# EAGLE design untitled (EAGLE 7.7.0)
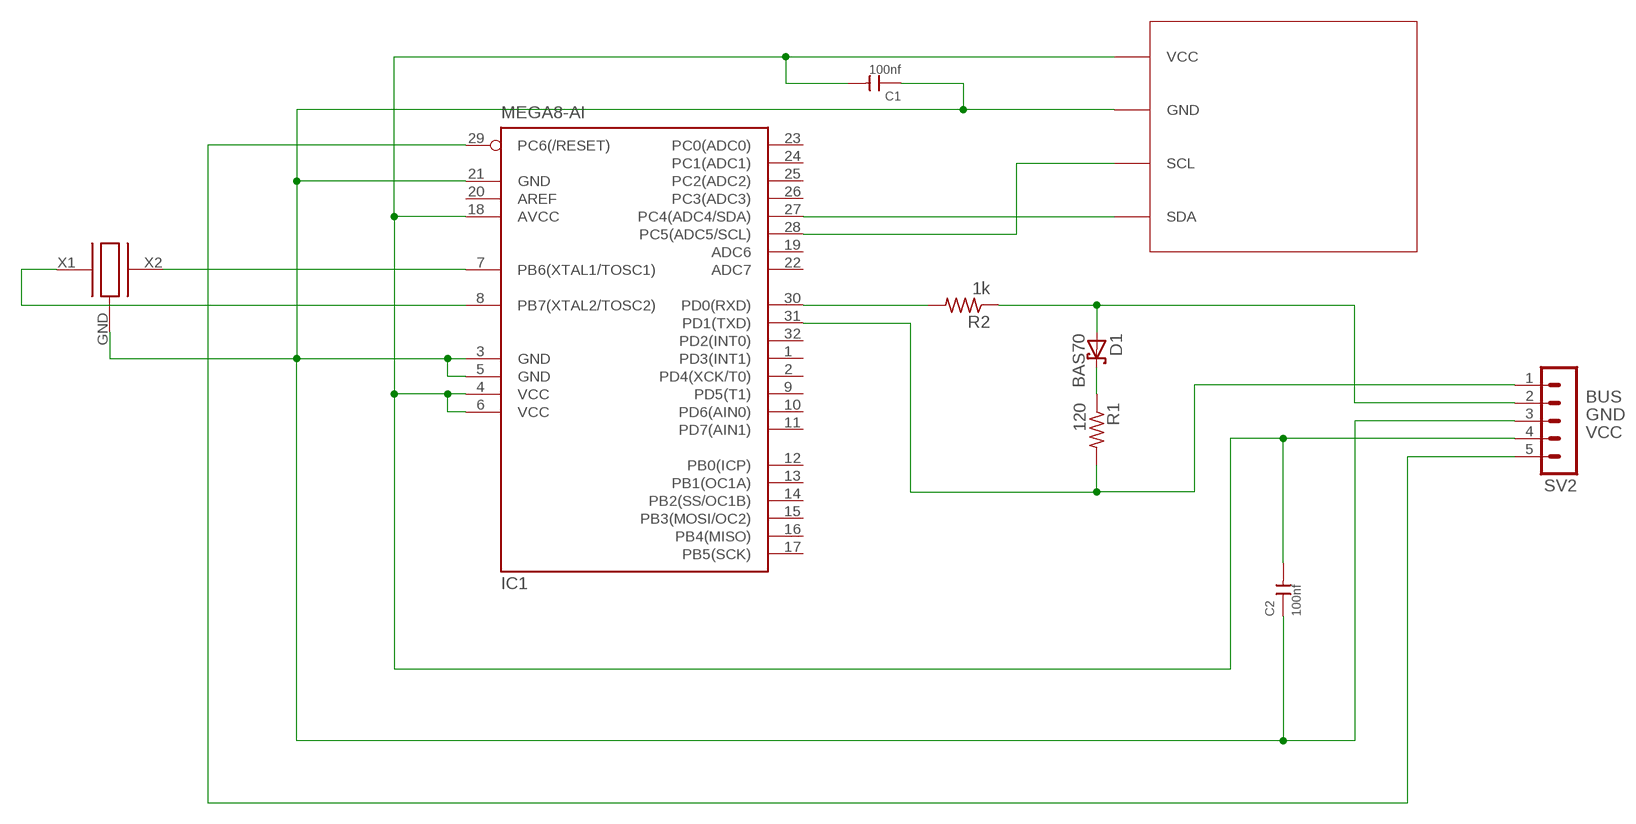
[diagram p0: schematic, sheet 1]

## Parts
C1  100nf  CERAMIC-10NF-50V-5%-X7R(0805)  [C0805]
C2  100nf  CERAMIC-10NF-50V-5%-X7R(0805)  [C0805]
D1  BAS70  [SOT23]
IC1  MEGA8-AI  [TQFP32-08]
R1  120  R-US_M0805  [M0805]
R2  1k  R-US_M0805  [M0805]
SV2  MA05-1  [MA05-1]
U$1  AMOLED_ADAFRUIT  [AMOLED_PCB]
U$2  MURATA_XTALL  [MURATA]

## Nets
BUS: D1.1(A) R2.1 SV2.2
GND: C1.1 C2.1 IC1.3(GND) IC1.5(GND) IC1.21(GND) SV2.3 U$1.GND U$2.GND
N$4: D1.3(C) R1.1
N$6: IC1.7(PB6(XTAL1/TOSC1)) U$2.X2
N$7: IC1.8(PB7(XTAL2/TOSC2)) U$2.X1
N$8: IC1.30(PD0(RXD)) R2.2
N$9: IC1.29(PC6(/RESET)) SV2.5
SCL: IC1.28(PC5(ADC5/SCL)) U$1.SCL
SDA: IC1.27(PC4(ADC4/SDA)) U$1.SDA
TX: IC1.31(PD1(TXD)) R1.2 SV2.1
VCC: C1.2 C2.2 IC1.4(VCC) IC1.6(VCC) IC1.18(AVCC) SV2.4 U$1.VCC
Unconnected: IC1.1(PD3(INT1)) IC1.2(PD4(XCK/T0)) IC1.9(PD5(T1)) IC1.10(PD6(AIN0)) IC1.11(PD7(AIN1)) IC1.12(PB0(ICP)) IC1.13(PB1(OC1A)) IC1.14(PB2(SS/OC1B)) IC1.15(PB3(MOSI/OC2)) IC1.16(PB4(MISO)) IC1.17(PB5(SCK)) IC1.19(ADC6) IC1.20(AREF) IC1.22(ADC7) IC1.23(PC0(ADC0)) IC1.24(PC1(ADC1)) IC1.25(PC2(ADC2)) IC1.26(PC3(ADC3)) IC1.32(PD2(INT0))

## Library data of the parts
C1 C2 = Seeed-OPL-Capacitor:CERAMIC-10NF-50V-5%-X7R(0805): 302010175; MPN: CC0805JRX7R9BB103; VALUE: 10nf
D1 = diode:BAS70: Silicon Schottky Diodes General-purpose diode for high-speed switching
IC1 = atmel:MEGA8: MICROCONTROLLER 8 Kbytes FLASH, 1 kbytes SRAM, 512 bytes EEPROM, USART, 6-channel 10 bit ADC, 2-channel 8 bit ADC Pin compatible with Atmega48, ATMega88, ATMega168 Source: avr.lbr; MPN: ATMEGA8-16AU; OC_FARNELL: 9171371; OC_NEWARK: 73M8863
R1 R2 = resistor:R-US_: RESISTOR, American symbol
SV2 = con-lstb:MA05-1: PIN HEADER; OC_FARNELL: unknown; OC_NEWARK: unknown
U$1 = 001aaa_my:AMOLED_ADAFRUIT
U$2 = 001aaa_my:MURATA_XTALL

## Board
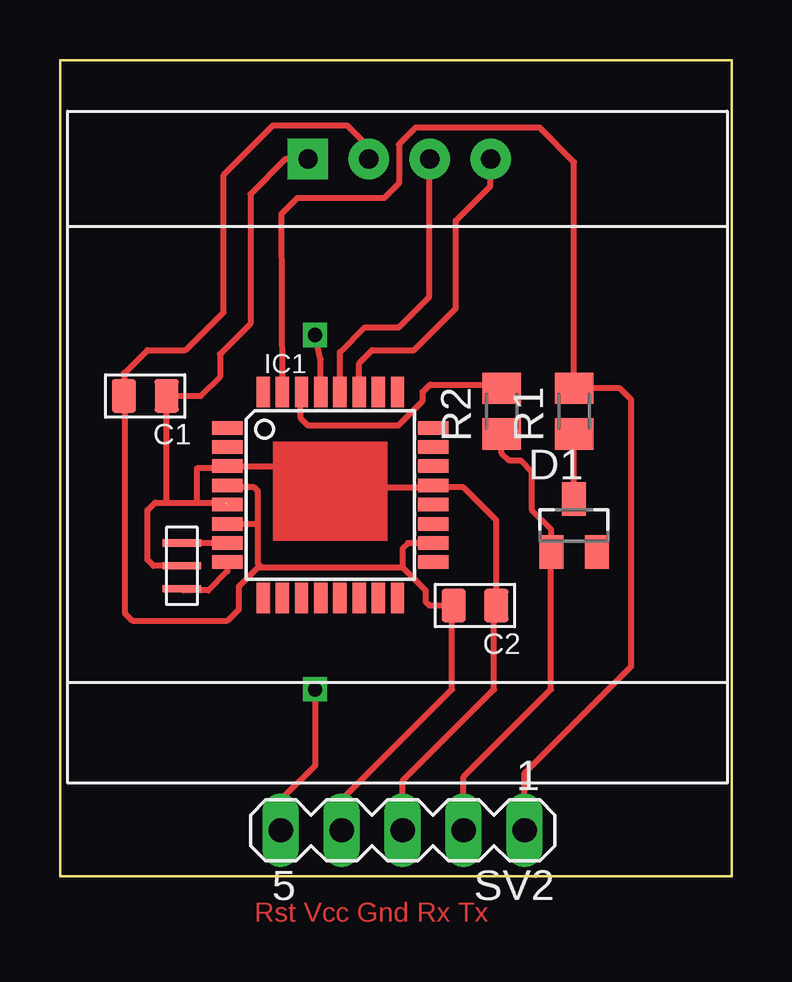
[diagram p1: board, top side]
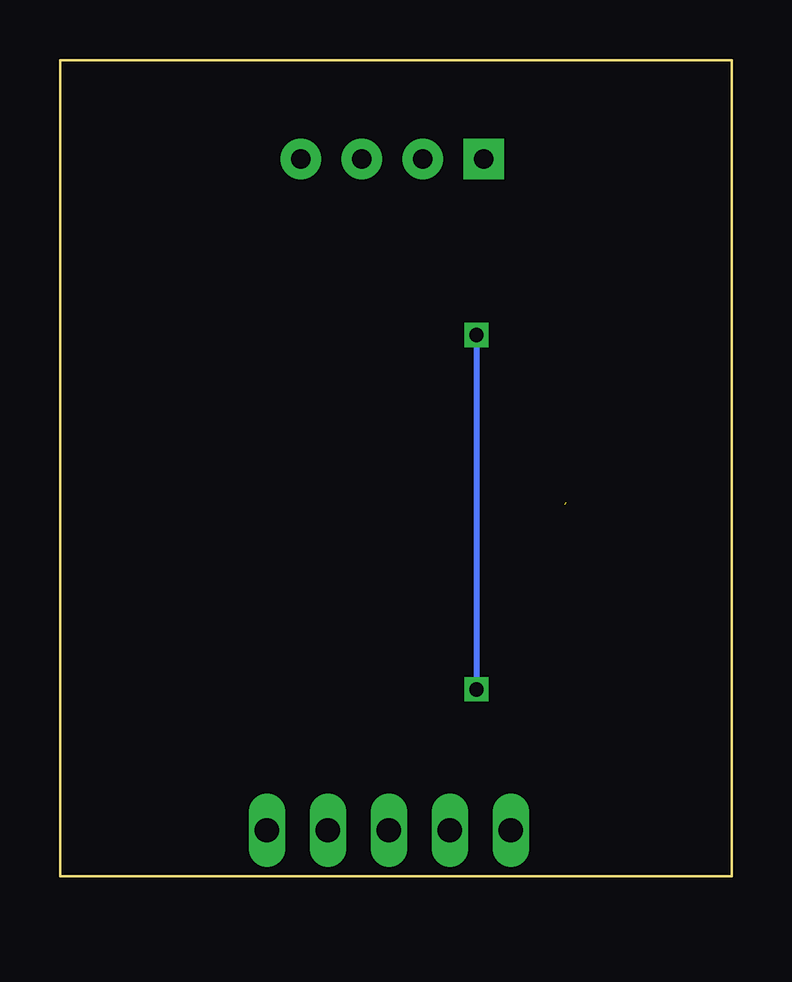
[diagram p2: board, bottom side, seen from below]

Size 28 x 34 mm. Coordinates in mm from the lower left corner, seen from the top.
Outline: 0,0 0,34 28,34 28,0 0,0
Copper layers (1*16): Top 0.035mm / dielectric 1.5mm / Bottom 0.035mm
Design rules "default": minimum track width 10mil, minimum drill 24mil, track to track 8mil, track to pad 8mil, pad to pad 8mil, via to via 8mil, smd to smd 8mil, copper to edge 40mil, drill to drill 8mil, minimum pad ring 10mil, minimum via ring 8mil, stop-mask expansion 4mil, vias tented up to drill 0mil, thermal gap 10mil

### Footprints (pad centres in the part's own frame; a part is rotated, then mirrored left to right if it is on the bottom)
C0805 = smd 1.397 x 1.016: 1 0,0.889; 2 0,-0.889
SOT23 = smd 1 x 1.4: 1 -0.95,-1.1; 2 0.95,-1.1; 3 0,1.1
TQFP32-08 = smd 1.27 x 0.559: 1 -4.293,2.8; 2 -4.293,2; 3 -4.293,1.2; 4 -4.293,0.4; 5 -4.293,-0.4; 6 -4.293,-1.2; 7 -4.293,-2; 8 -4.293,-2.8; 17 4.293,-2.8; 18 4.293,-2; 19 4.293,-1.2; 20 4.293,-0.4; 21 4.293,0.4; 22 4.293,1.2; 23 4.293,2; 24 4.293,2.8 | smd 0.559 x 1.27: 9 -2.8,-4.293; 10 -2,-4.293; 11 -1.2,-4.293; 12 -0.4,-4.293; 13 0.4,-4.293; 14 1.2,-4.293; 15 2,-4.293; 16 2.8,-4.293; 25 2.8,4.293; 26 2,4.293; 27 1.2,4.293; 28 0.4,4.293; 29 -0.4,4.293; 30 -1.2,4.293; 31 -2,4.293; 32 -2.8,4.293
M0805 = smd 1.3 x 1.6: 1 -0.95,0; 2 0.95,0
MA05-1 = drill 1.016 long: 1 -5.08,0; 2 -2.54,0; 3 0,0; 4 2.54,0; 5 5.08,0
AMOLED_PCB = drill 0.8 pad 1.676 square: GND 10.02,26 | drill 0.8 pad 1.676: SCL 15.1,26; SDA 17.64,26; VCC 12.56,26
MURATA = smd 0.3 x 1.6: GND 0,0; X1 -0.95,0; X2 0.95,0

### Placement (x,y rotation side)
C1  3.56,20 270 top
C2  17.3,11.27 270 top
D1  21.43,14.61 0 top
IC1  11.27,15.88 0 top
R1  21.43,19.37 90 top
R2  18.41,19.37 90 top
SV2  14.29,1.91 180 top
U$1  0.32,3.87 0 top
U$2  5.08,12.92 90 top

### Tracks (layer width: path | path; a pad name or v marks a point on that pad's centre or on a via)
BUS
  Top 0.254: R2.1 18.41,17.62 18.73,17.3 19.21,17.3 19.68,16.83 19.68,15.24 20.48,14.44 D1.1 20.48,7.78 16.83,4.13 SV2.2
GND  (1 unrouted)
  Top 0.254: U$1.GND 9.39,29.87 7.94,28.42 7.94,23.02 6.67,21.75 6.67,20.8 5.87,20 C1.1 4.45,15.56 | SV2.3 14.29,3.97 18.1,7.78 18.1,11.18 C2.1 18.19,14.83 16.83,16.19 15.65,16.19 IC1.21 15.48,16.19 13.49,16.19 12.61,17.07 IC1.3 6.83,16.99 5.71,16.99 5.71,15.56 | U$2.GND 3.9,12.92 3.65,13.18 3.65,15.24 3.97,15.56 4.45,15.56 | 4.45,15.56 5.71,15.56 | 5.71,15.56 6.9,15.56
N$4
  Top 0.254: D1.3 R1.1
N$6
  Top 0.254: IC1.7 6.95,13.87 U$2.X2
N$7
  Top 0.254: IC1.8 6.98,12.69 6.19,11.91 5.15,11.91 U$2.X1
N$8
  Top 0.254: IC1.30 10.03,20.19 10.03,19.08 10.35,18.76 14.1,18.76 15.11,19.78 15.11,20.16 15.43,20.48 18.25,20.48 R2.2
N$9  (via drill 0.6)
  Top 0.254: IC1.29 10.87,21.51 v10.64,22.54 | v10.64,7.78 10.64,4.6 9.21,3.17 SV2.5
  Bottom 0.254: v10.64,22.54 v10.64,7.78
SCL
  Top 0.254: IC1.28 11.67,21.83 12.7,22.86 14.13,22.86 15.4,24.13 15.4,29.86 U$1.SCL
SDA
  Top 0.254: IC1.27 12.47,21.36 13.02,21.91 14.76,21.91 16.51,23.65 16.51,27.3 17.94,28.73 17.94,29.86 U$1.SDA
TX
  Top 0.254: IC1.31 9.24,27.59 9.91,28.26 13.53,28.26 14.13,28.86 14.13,30.48 14.83,31.18 20,31.18 21.43,29.75 R1.2 23.34,20.32 23.81,19.84 23.81,8.73 19.37,4.29 SV2.1
VCC
  Top 0.254: U$1.VCC 12.88,30.37 11.97,31.27 8.89,31.27 6.83,29.21 6.83,23.5 5.24,21.91 3.65,21.91 2.7,20.95 2.67,20.95 C1.2 2.7,20 2.7,10.95 3.02,10.64 6.99,10.64 7.46,11.11 7.46,12.06 8.26,12.86 8.41,12.86 | IC1.18 15.53,13.94 | 6.86,16.22 IC1.4 | 7.07,14.76 IC1.6 8.17,14.68 8.26,14.76 | 15.5,13.81 IC1.18 | 6.9,16.35 IC1.4 | C2.2 16.19,11.68 16.19,11.75 | 8.41,12.86 14.29,12.86 | 8.41,12.86 8.26,13.02 8.26,14.76 | SV2.4 11.75,3.17 16.35,7.78 16.35,11.21 C2.2 | 14.29,12.86 15.24,11.91 15.24,11.43 15.4,11.27 C2.2 | IC1.18 14.51,13.88 14.29,13.65 14.29,12.86 | 8.26,14.76 8.26,16.03 8.1,16.19 7.06,16.19 IC1.4
(copper drawn outside any net)
  shapes: Top area x1

### Text on the board
Top: Rst Vcc Gnd Rx Tx